# Altium schematic sheet Level_shifter.SchDoc: =project_title
size Tabloid; CompanyName: Luxonis Holding; Organization: Luxonis Holding; Address1: 1925 Harmony Park Drive; Address2: Westminster, CO; Address3: 80234; Address4: United States; SheetNumber: 7; SheetTotal: 8
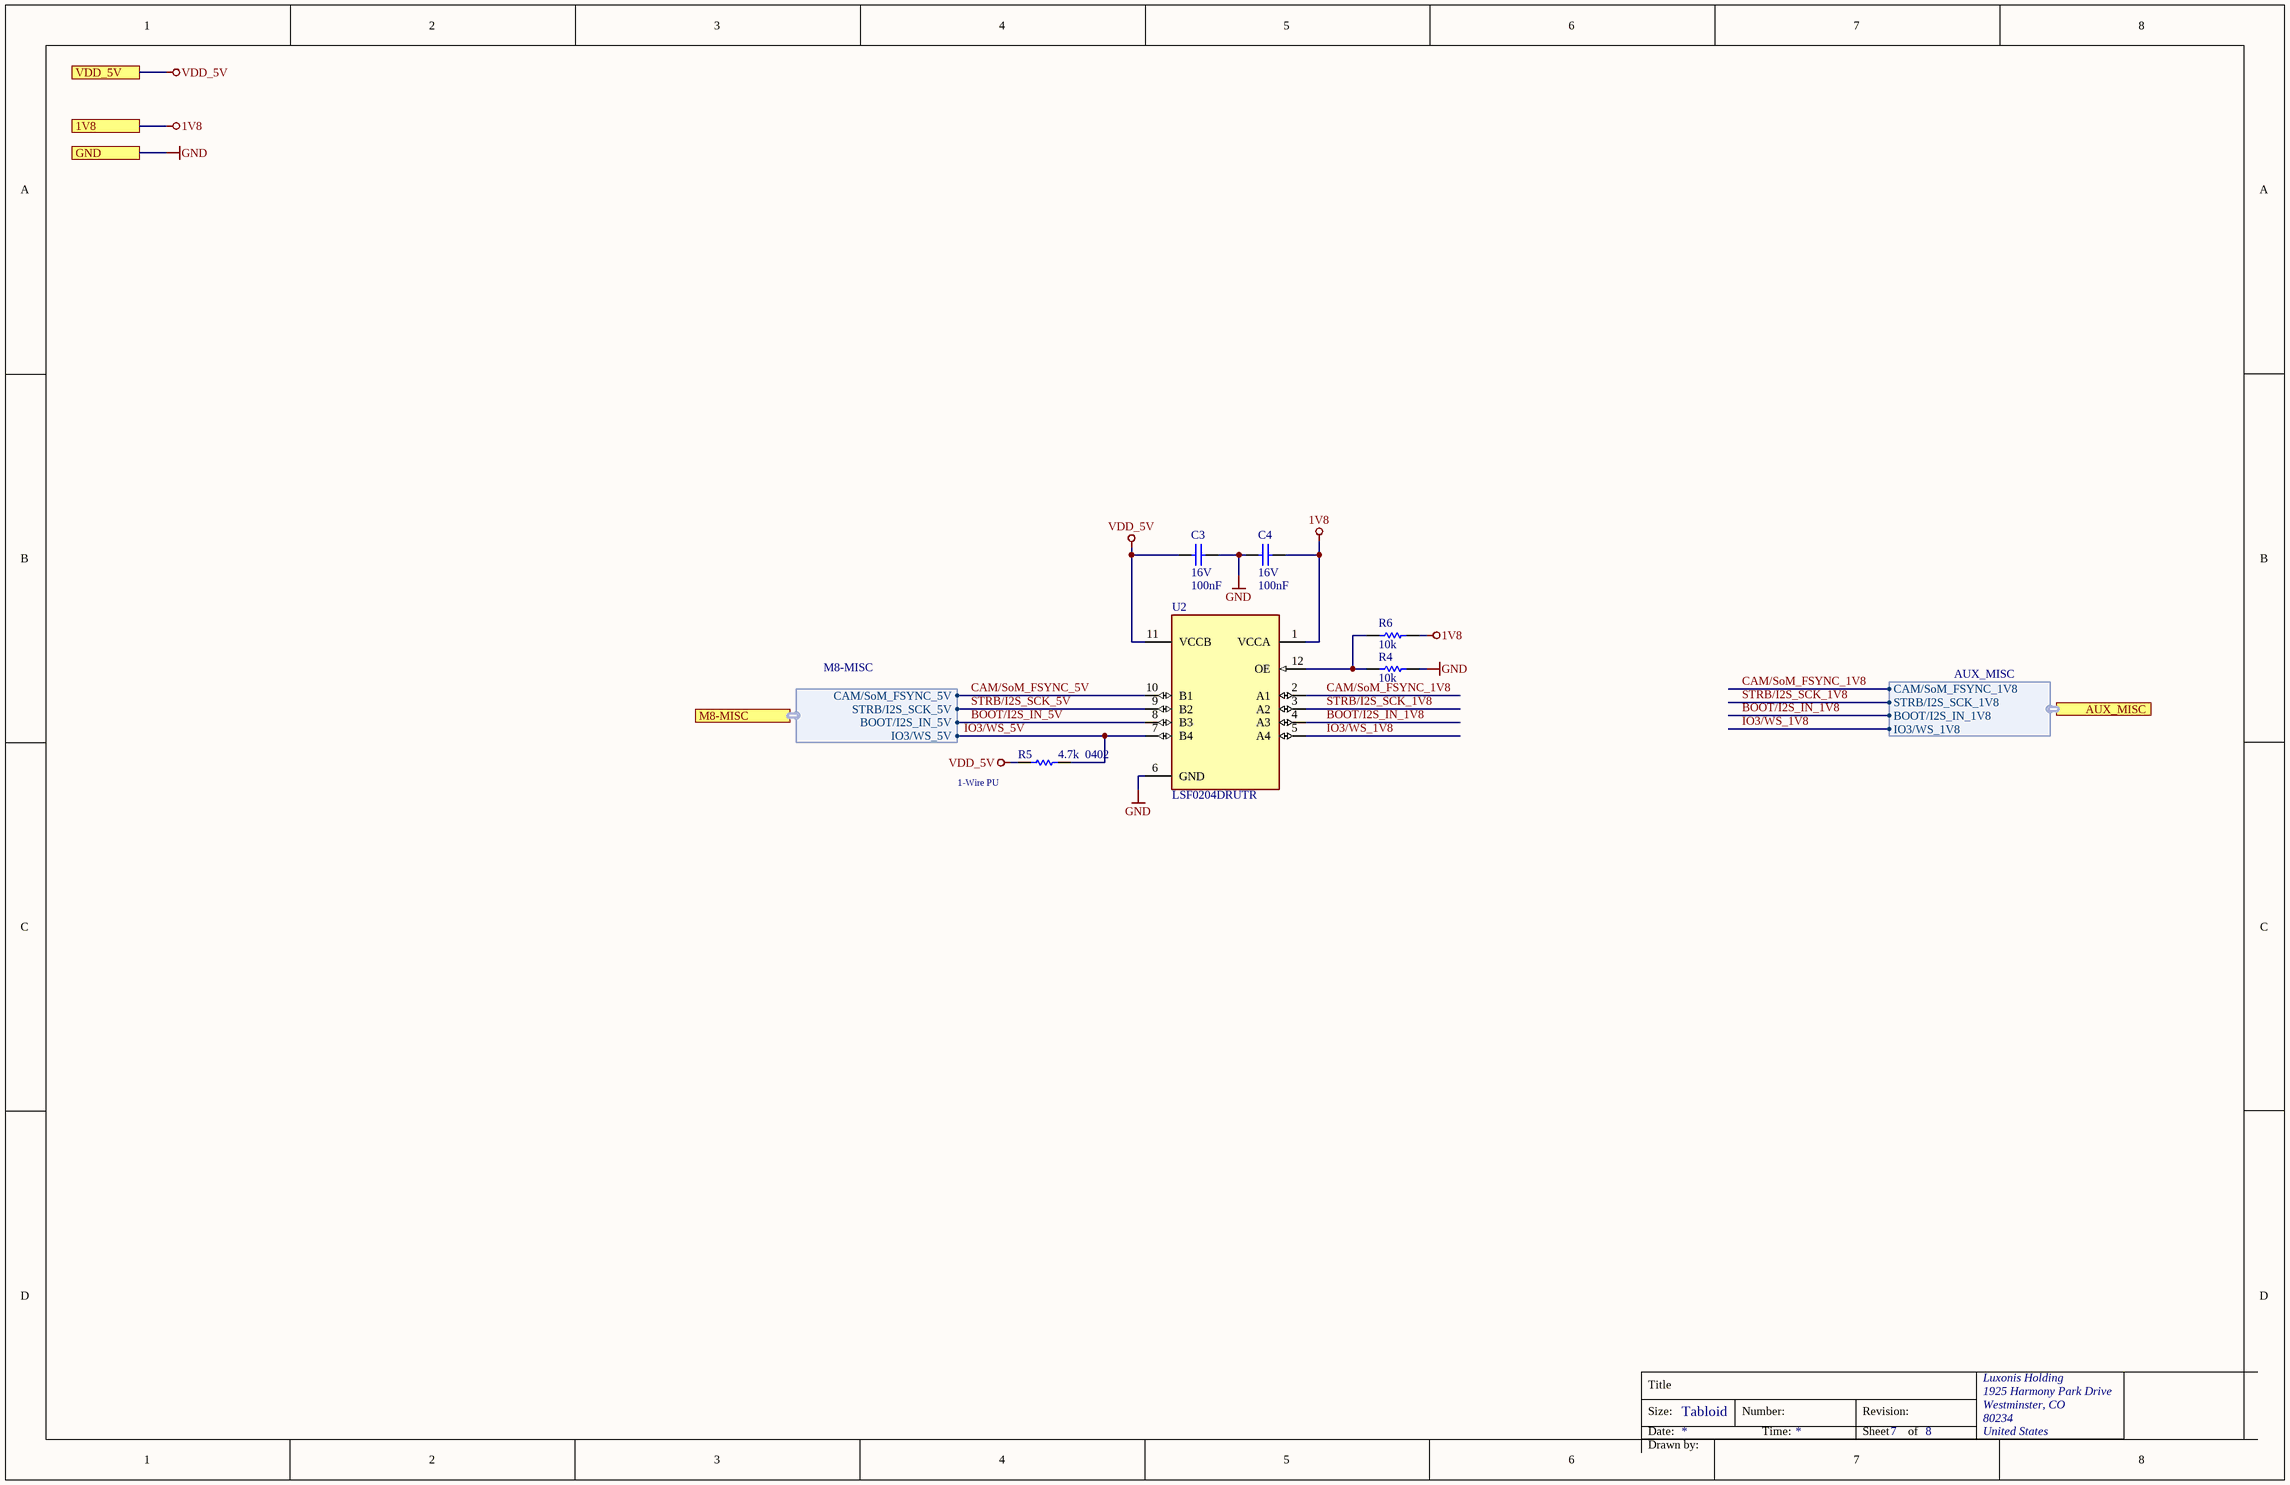
[diagram p0: Level_shifter.SchDoc]

## Parts
C3  value 100nF  Voltage Rating: 16V  [CAPC0402(1005)60_N]  (hidden comment: CL05B104KO5NFNC)
C4  value 100nF  Voltage Rating: 16V  [CAPC0402(1005)60_N]  (hidden comment: CL05B104KO5NFNC)
R4  value 10k  [RESC0402(1005)_N]  (hidden comment: RC0402FR-1310KL)
R5  value 4.7k  Case/Package: 0402  [RESC0402(1005)_N]  (hidden comment: RC0402FR-074K7L)
R6  value 10k  [RESC0402(1005)_N]  (hidden comment: RC0402FR-1310KL)
U2  LSF0204DRUTR  [LSF0204DRUTR]

## Ports
1V8, AUX_MISC (harness AUX_MISC), GND, M8-MISC (harness M8-MISC), VDD_5V

## Harnesses
AUX_MISC: CAM/SoM_FSYNC_1V8, STRB/I2S_SCK_1V8, BOOT/I2S_IN_1V8, IO3/WS_1V8
M8-MISC: CAM/SoM_FSYNC_5V, STRB/I2S_SCK_5V, BOOT/I2S_IN_5V, IO3/WS_5V

## Nets
1V8: C4.2 R6.2 U2.1(VCCA) ; port 1V8
GND: C3.2 C4.1 R4.2 U2.6(GND) ; port GND
VDD_5V: C3.1 R5.1 U2.11(VCCB) ; port VDD_5V
BOOT/I2S_IN_1V8: U2.4(A3) ; port AUX_MISC.BOOT/I2S_IN_1V8
BOOT/I2S_IN_5V: U2.8(B3) ; port M8-MISC.BOOT/I2S_IN_5V
CAM/SoM_FSYNC_1V8: U2.2(A1) ; port AUX_MISC.CAM/SoM_FSYNC_1V8
CAM/SoM_FSYNC_5V: U2.10(B1) ; port M8-MISC.CAM/SoM_FSYNC_5V
IO3/WS_1V8: U2.5(A4) ; port AUX_MISC.IO3/WS_1V8
IO3/WS_5V: R5.2 U2.7(B4) ; port M8-MISC.IO3/WS_5V
STRB/I2S_SCK_1V8: U2.3(A2) ; port AUX_MISC.STRB/I2S_SCK_1V8
STRB/I2S_SCK_5V: U2.9(B2) ; port M8-MISC.STRB/I2S_SCK_5V
NetR4_1: R4.1 R6.1 U2.12(OE)

## Notes on the sheet
- (near R5) 1-Wire PU
- Title
- Size:
- Date:
- Tabloid
- Number:
- Time:
- Revision:
- Sheet
- of
- Drawn by:

## Library data of the parts
C3 C4 = CMP-108-000002-6: CAP CER 0.1UF 16V X7R 0402 10%; Manufacturer 1: Samsung; Dielectric: X7R; Mounting Technology: SMT; Width: 0.02inch; Design Item ID: CL05B104KO5NFNC; Tolerance: 10%; Length: 1mm; Case/Package: 0402; ComponentLink1URL: https://datasheet.ciiva.com/25767/cl05b104ko5nfnc-25767124.pdf?src-supplier=Digi-Key; Depth: 0.5mm; Min Operating Temperature: -55°C; Manufacturer Part Number 1: CL05B104KO5NFNC; ComponentLink1Description: https://datasheet.ciiva.com/25767/cl05b104ko5nfnc-25767124.pdf?src-supplier=Digi-Key; Height: 0.5mm; Max Operating Temperature: 125°C
R4 R6 = CMP-115-000004-8: RES SMD 10K OHM 1% 1/16W 0402; Manufacturer 1: Yageo; Power Rating: 62.5mW; Temperature Coefficient: 100ppm/°C; Voltage Rating: 50V; Tolerance: 1%; Max Operating Temperature: 155°C; Case/Package: 0402; Manufacturer Part Number 1: RC0402FR-1310KL; Min Operating Temperature: -55°C; Design Item ID: RC0402FR-1310KL
R5 = CMP-013-000016-9: RES SMD 4.7K OHM 1% 1/16W 0402; Manufacturer 1: Yageo; Power Rating: 62.5mW; Voltage Rating: 50V; Min Operating Temperature: -55°C; Manufacturer Part Number 1: RC0402FR-074K7L; Tolerance: 1%; Design Item ID: RC0402FR-074K7L; Max Operating Temperature: 155°C
U2 = CMP-362-000000-2: Voltage Level Translator Bidirectional 1 Circuit 4 Channel 100Mbps 12-UQFN _1.7x2_; Manufacturer 1: TI; MF: Texas Instruments; Manufacturer Part Number 1: LSF0204DRUTR; Case/Package: QCCN; MP: LSF0204DRUTR; Package: UQFN-12 Texas Instruments; Pins: 12